# Altium schematic sheet Sheet1.SchDoc
size 292 x 193 mm; ApprovedBy: A. Jelinski; CheckedBy: A. Jelinski; Author: M. Roszczyk; CompanyName: SKA Robotics; DrawnBy: M. Roszczyk; SheetNumber: 1; SheetTotal: 1
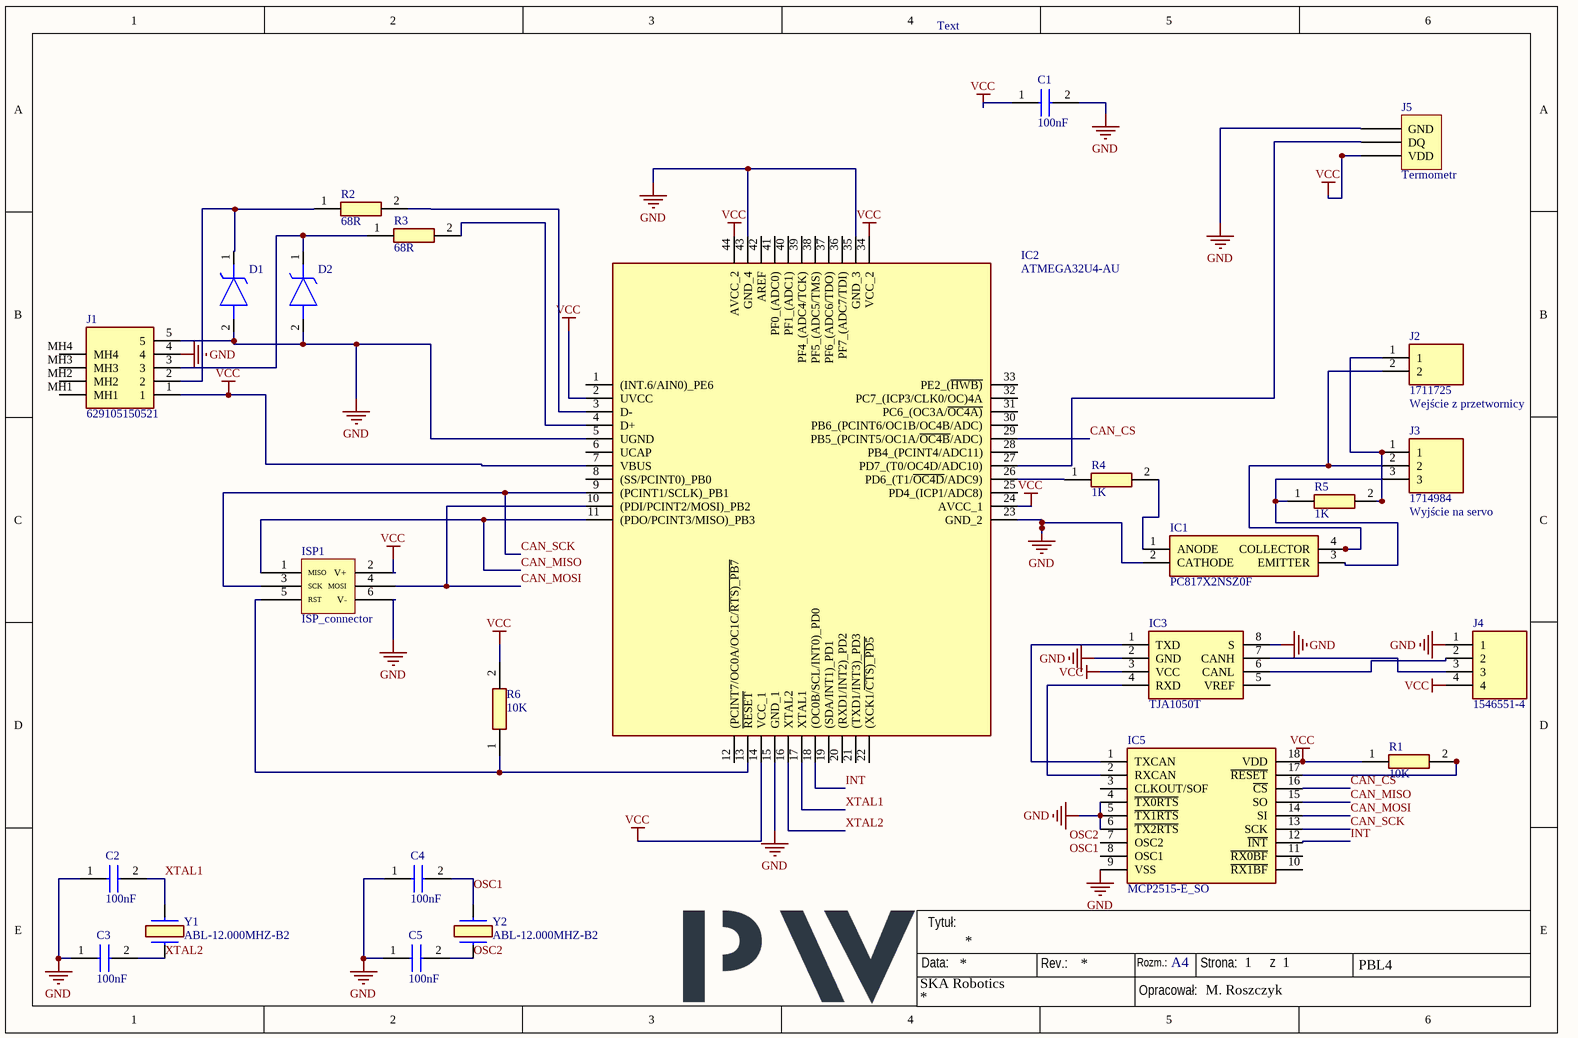
[diagram p0: Sheet1.SchDoc]

## Parts
C1  100nF  [CAPC2012X94N]
C2  100nF  [CAPC2012X94N]
C3  100nF  [CAPC2012X94N]
C4  100nF  [CAPC2012X94N]
C5  100nF  [CAPC2012X94N]
D1  EDZVT2R3.9B  [SODFL1608X70N]  (value not drawn)
D2  EDZVT2R3.9B  [SODFL1608X70N]  (value not drawn)
IC1  PC817X2NSZ0F  [DIP762W60P254L458H400Q4N]
IC2  ATMEGA32U4-AU  [QFP80P1200X1200X120-44N]
IC3  TJA1050T  [SOIC127P600X175-8N]
IC5  MCP2515-E_SO  [SOIC127P1030X265-18N]
ISP1  ISP_connector
J1  629105150521  [629105150521]
J2  1711725  [1711725]
J3  1714984  [1714984]
J4  1546551-4  [SHDR4W91P0X350_1X4_1400X730X875P]
J5  Termometr  [PCBComponent_1]
R1  10K  [RESC2012X65N]
R2  68R  [RESC2012X65N]
R3  68R  [RESC2012X65N]
R4  1K  [RESC2012X65N]
R5  1K  [RESC2012X65N]
R6  10K  [RESC2012X65N]
Y1  ABL-12.000MHZ-B2  [ABL]
Y2  ABL-12.000MHZ-B2  [ABL]

## Nets
GND: C1.2 C2.1 C3.1 C4.1 C5.1 D1.2(A) D2.2(A) IC1.2(CATHODE) IC2.5(UGND) IC2.15(GND_1) IC2.23(GND_2) IC2.35(GND_3) IC2.43(GND_4) IC3.2(GND) IC3.8(S) IC5.4(~{TX0RTS}) IC5.5(~{TX1RTS}) IC5.6(~{TX2RTS}) IC5.9(VSS) ISP1.6(V-) J1.4 J1.5 J4.1 J5.1(GND)
VCC: C1.1 IC2.2(UVCC) IC2.7(VBUS) IC2.14(VCC_1) IC2.24(AVCC_1) IC2.34(VCC_2) IC2.44(AVCC_2) IC3.3(VCC) IC5.18(VDD) ISP1.2(V+) J1.1 J4.4 J5.3(VDD) R1.1 R6.2
CAN_CS: IC2.29(PB5_(PCINT5/OC1A/~{OC4B}/ADC)) IC5.16(~{CS})
CAN_MISO: IC2.11((PDO/PCINT3/MISO)_PB3) IC5.15(SO) ISP1.1(MISO)
CAN_MOSI: IC2.10((PDI/PCINT2/MOSI)_PB2) IC5.14(SI) ISP1.4(MOSI)
CAN_SCK: IC2.9((PCINT1/SCLK)_PB1) IC5.13(SCK) ISP1.3(SCK)
INT: IC2.18((OC0B/SCL/INT0)_PD0) IC5.12(~{INT})
OSC1: C4.2 IC5.8(OSC1) Y2.2
OSC2: C5.2 IC5.7(OSC2) Y2.1
XTAL1: C2.2 IC2.17(XTAL1) Y1.2
XTAL2: C3.2 IC2.16(XTAL2) Y1.1
NetD1_1: D1.1(K) J1.2 R2.1
NetD2_1: D2.1(K) J1.3 R3.1
NetIC1_1: IC1.1(ANODE) R4.2
NetIC1_3: IC1.3(EMITTER) J3.3 R5.1
NetIC1_4: IC1.4(COLLECTOR) J2.2 J3.2
NetIC2_3: IC2.3(D-) R2.2
NetIC2_4: IC2.4(D+) R3.2
NetIC2_13: IC2.13(~{RESET}) ISP1.5(RST) R6.1
NetIC2_26: IC2.26(PD6_(T1/~{OC4D}/ADC9)) R4.1
NetIC2_27: IC2.27(PD7_(T0/OC4D/ADC10)) J5.2(DQ)
NetIC3_1: IC3.1(TXD) IC5.1(TXCAN)
NetIC3_4: IC3.4(RXD) IC5.2(RXCAN)
NetIC3_6: IC3.6(CANL) J4.2
NetIC3_7: IC3.7(CANH) J4.3
NetIC5_17: IC5.17(~{RESET}) R1.2
NetJ2_1: J2.1 J3.1 R5.2

Not connected (* = marked no-connect by the designer): IC2 1((INT.6/AIN0)_PE6) 6(UCAP) 8((SS/PCINT0)_PB0) 12((PCINT7/OC0A/OC1C/~{RTS)_PB7}) 19((SDA/INT1)_PD1) 20((RXD1/INT2)_PD2) 21((TXD1/INT3)_PD3) 22((XCK1/~{CTS)_PD5}) 25(PD4_(ICP1/ADC8)) 28(PB4_(PCINT4/ADC11)) 30(PB6_(PCINT6/OC1B/OC4B/ADC)) 31(PC6_(OC3A/~{OC4A)}) 32(PC7_(ICP3/CLK0/OC)4A) 33(PE2_(~{HWB)}) 36(PF7_(ADC7/TDI)) 37(PF6_(ADC6/TDO)) 38(PF5_(ADC5/TMS)) 39(PF4_(ADC4/TCK)) 40(PF1_(ADC1)) 41(PF0_(ADC0)) 42(AREF); IC3 5(VREF); IC5 3(CLKOUT/SOF) 10(~{RX1BF}) 11(~{RX0BF}); J1 MH1 MH2 MH3 MH4

## Notes on the sheet
- Text
- Wejście z przetwornicy
- (near J3) Wyjście na servo
- Data:
- Tytuł:
- Rev.:
- Rozm.:
- A4
- Strona:
- z
- PBL4
- Opracował:

## Library data of the parts
C1-C5 = 08055A150JAT2A: Capacitor; Manufacturer_Name: AVX; Datasheet Link: https://componentsearchengine.com/Datasheets/1/06031A100FAT2A.pdf; Height: 0.94mm; Manufacturer_Part_Number: 08055A150JAT2A; Mouser Part Number: 581-08055A150J; Mouser Price/Stock: https://www.mouser.co.uk/ProductDetail/AVX/08055A150JAT2A?qs=pZVDklL%2Fs8hiEua37sqbaA%3D%3D; Arrow Part Number: 08055A150JAT2A; Arrow Price/Stock: https://www.arrow.com/en/products/08055a150jat2a/avx?region=nac
D1 D2 = EDZVT2R3.9B: Zener Diode; Manufacturer_Name: ROHM Semiconductor; Datasheet Link: https://datasheet.datasheetarchive.com/originals/distributors/Datasheets_SAMA/4f21d5300cb411da288c500765791f77.pdf; Height: 0.7mm; Manufacturer_Part_Number: EDZVT2R3.9B; Mouser Part Number: 755-EDZVT2R3.9B; Mouser Price/Stock: https://www.mouser.co.uk/ProductDetail/ROHM-Semiconductor/EDZVT2R3.9B?qs=QcFhgjUTvvp7RoPbadtb3A%3D%3D
IC1 = PC817X2NSZ0F: Integrated Circuit; Manufacturer_Name: Sharp Microelectronics; Datasheet Link: https://datasheet.datasheetarchive.com/originals/distributors/Datasheets_SAMA/458e45842a103a05998fcebbd6f7366e.pdf; Height: 4mm; Manufacturer_Part_Number: PC817X2NSZ0F; Mouser Part Number: N/A; Mouser Price/Stock: https://www.mouser.co.uk/ProductDetail/Sharp-Microelectronics/PC817X2NSZ0F?qs=6kT3pPPHxnU7uYWM8Yy85A%3D%3D
IC2 = ATMEGA32U4-AU: Integrated Circuit; Manufacturer_Name: Microchip; Datasheet Link: http://www.atmel.com/images/atmel-7766-8-bit-avr-atmega16u4-32u4_summary.pdf; Height: 1.2mm; Manufacturer_Part_Number: ATMEGA32U4-AU; Mouser Part Number: 556-ATMEGA32U4-AU; Mouser Price/Stock: https://www.mouser.co.uk/ProductDetail/Microchip-Technology-Atmel/ATMEGA32U4-AU?qs=SSucg2PyLi7mKWjHIsNJ3w%3D%3D; Arrow Part Number: ATMEGA32U4-AU; Arrow Price/Stock: https://www.arrow.com/en/products/atmega32u4-au/microchip-technology?region=nac
IC3 = TJA1050T: Integrated Circuit; Manufacturer_Name: NXP; Datasheet Link: https://datasheet.datasheetarchive.com/originals/distributors/Datasheets-NXP/DSANXP010005907.pdf; Height: 1.75mm; Manufacturer_Part_Number: TJA1050T; Mouser Part Number: N/A; Mouser Price/Stock: https://www.mouser.co.uk/ProductDetail/NXP-Semiconductors/TJA1050T?qs=WhRErS6oET%252B5mtiFrt9ZMQ%3D%3D
IC5 = MCP2515-E_SO: Integrated Circuit; Manufacturer_Name: Microchip; Manufacturer_Part_Number: MCP2515-E/SO; Datasheet Link: https://datasheet.datasheetarchive.com/originals/distributors/Datasheets-34/DSA-675135.pdf; Height: 2.65mm; Mouser Part Number: 579-MCP2515-E/SO; Mouser Price/Stock: https://www.mouser.co.uk/ProductDetail/Microchip-Technology-Atmel/MCP2515-E-SO?qs=y1t9dHv1DsLUSXaU9a01fg%3D%3D; Arrow Part Number: MCP2515-E/SO; Arrow Price/Stock: https://www.arrow.com/en/products/mcp2515-eso/microchip-technology?region=nac
J1 = 629105150521: Connector; Manufacturer_Name: Wurth Elektronik; Datasheet Link: https://www.we-online.com/components/products/datasheet/629105150521.pdf; Height: 2.86mm; Manufacturer_Part_Number: 629105150521; Mouser Part Number: 710-629105150521; Mouser Price/Stock: https://www.mouser.co.uk/ProductDetail/Wurth-Elektronik/629105150521?qs=a9WhcLg8qCzXiH7kZP8GRQ%3D%3D
J2 = 1711725: Connector; Manufacturer_Name: Phoenix Contact; Datasheet Link: http://www.phoenixcontact.net/product/1711725; Height: 18.2mm; Manufacturer_Part_Number: 1711725; Mouser Part Number: 651-1711725; Mouser Price/Stock: https://www.mouser.co.uk/ProductDetail/Phoenix-Contact/1711725?qs=F79NelsxgYFLEb9U5DotcA%3D%3D; Arrow Part Number: 1711725; Arrow Price/Stock: https://www.arrow.com/en/products/1711725/phoenix-contact?region=nac
J3 = 1714984: Connector; Manufacturer_Name: Phoenix Contact; Datasheet Link: https://www.phoenixcontact.com/online/portal/us/?uri=pxc-oc-itemdetail:pid=1714984&library=usen&pcck=P-11-01-05&tab=1&selectedCategory=ALL; Height: 21.7mm; Manufacturer_Part_Number: 1714984; Mouser Part Number: 651-1714984; Mouser Price/Stock: https://www.mouser.co.uk/ProductDetail/Phoenix-Contact/1714984?qs=cyzODkzcbwBLTTPxtXl6gQ%3D%3D; Arrow Part Number: 1714984; Arrow Price/Stock: https://www.arrow.com/en/products/1714984/phoenix-contact?region=nac
J4 = 1546551-4: Connector; Manufacturer_Name: TE Connectivity; Datasheet Link: https://www.te.com/commerce/DocumentDelivery/DDEController?Action=showdoc&DocId=Customer+Drawing%7F1546551%7FB%7Fpdf%7FEnglish%7FENG_CD_1546551_B.pdf%7F1546551-4; Height: 8.75mm; Manufacturer_Part_Number: 1546551-4; Mouser Part Number: 571-1546551-4; Mouser Price/Stock: https://www.mouser.co.uk/ProductDetail/TE-Connectivity/1546551-4?qs=m%2FhmcwQ75LnAjOUb0MU8sQ%3D%3D; Arrow Part Number: 1546551-4; Arrow Price/Stock: https://www.arrow.com/en/products/1546551-4/te-connectivity?region=nac
J5 = 3goldpin
R1-R6 = CPF0805B100RE1: Resistor; Manufacturer_Name: TE Connectivity; Datasheet Link: http://docs-europe.electrocomponents.com/webdocs/13d1/0900766b813d116f.pdf; Height: 0.65mm; Manufacturer_Part_Number: CPF0805B100RE1; Mouser Part Number: 279-CPF0805B100RE1; Mouser Price/Stock: https://www.mouser.co.uk/ProductDetail/TE-Connectivity-Holsworthy/CPF0805B100RE1?qs=9ylKvqdyudkCWLPT1QvLZQ%3D%3D; Arrow Part Number: CPF0805B100RE1; Arrow Price/Stock: https://www.arrow.com/en/products/cpf0805b100re1/te-connectivity?region=nac
Y1 Y2 = ABL-12.000MHZ-B2: Crystal or Oscillator; Manufacturer_Name: ABRACON; Datasheet Link: https://abracon.com/Resonators/ABL.pdf; Manufacturer_Part_Number: ABL-12.000MHZ-B2; Mouser Part Number: 815-ABL-12-B2; Mouser Price/Stock: https://www.mouser.co.uk/ProductDetail/ABRACON/ABL-12000MHZ-B2?qs=zLkLEWnxMJzcerUKP0J8Mw%3D%3D; Arrow Part Number: ABL-12.000MHZ-B2; Arrow Price/Stock: https://www.arrow.com/en/products/abl-12.000mhz-b2/abracon?region=nac